# EAGLE schematic arduino_fio (EAGLE 5.00)
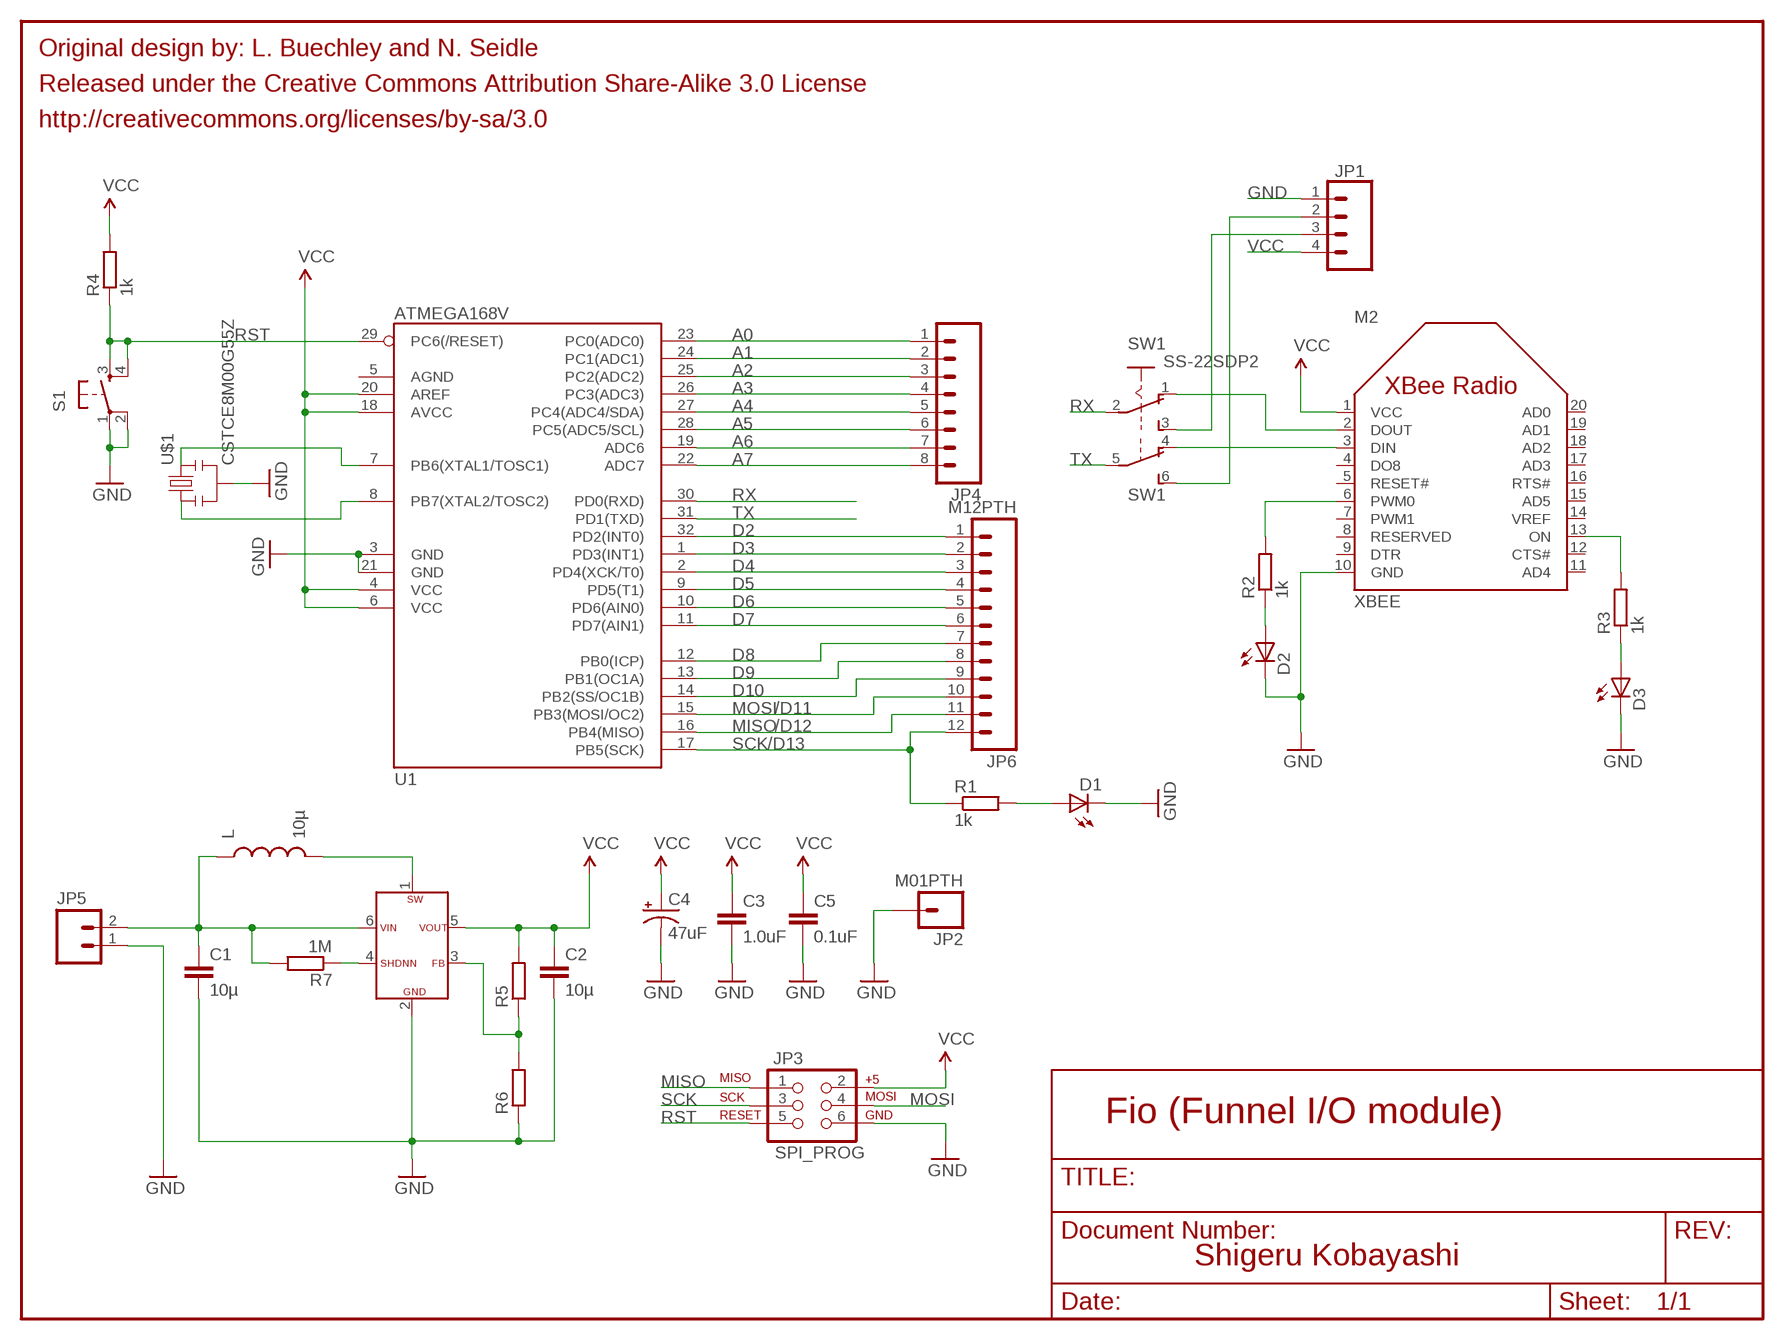
[diagram p0: schematic, sheet 1]

## Parts
C1  10µ  C-EUC0805K  [C0805K]
C2  10µ  C-EUC0805K  [C0805K]
C3  1.0uF  CAP0603  [0603]
C4  47uF  CAP_POL3528  [EIA3528]
C5  0.1uF  CAP0603  [0603]
D1  LEDCHIPLED_0805  [CHIPLED_0805]
D2  LEDCHIPLED_0805  [CHIPLED_0805]
D3  LEDCHIPLED_0805  [CHIPLED_0805]
IC1  AS1322  [SOT23-6]
JP1  Serial  M04PTH  [1X04]
JP2  M01PTH  [1X01]
JP3  SPI_PROG  AVR_SPI_PRG_6NS  [2X3-NS]
JP4  M08  [1X08]
JP5  M02-JST-2MM-SMT  [S2B-PH]
JP6  M12PTH  [1X12]
L  10µ  A921CY  [D63LCB]
M2  XBEE  [XBEE]
R1  1k  R-EU_R0603  [R0603]
R2  1k  R-EU_R0603  [R0603]
R3  1k  R-EU_R0603  [R0603]
R4  1k  R-EU_R0603  [R0603]
R5  R-EU_R0603  [R0603]
R6  R-EU_R0603  [R0603]
R7  1M  R-EU_R0603  [R0603]
S1  TAC_SWITCHSND  [TACTILE_SWITCH_SMD]
SW1  SS-22SDP2  [SS-22SDP2]
U1  ATMEGA168V  ATMEGA168  [TQFP32-08]
U$1  CSTCE8M00G55Z  RESONATORSMD  [RESONATOR-SMD]

## Nets
A0: JP4.1 U1.23(PC0(ADC0))
A1: JP4.2 U1.24(PC1(ADC1))
A2: JP4.3 U1.25(PC2(ADC2))
A3: JP4.4 U1.26(PC3(ADC3))
A4: JP4.5 U1.27(PC4(ADC4/SDA))
A5: JP4.6 U1.28(PC5(ADC5/SCL))
A6: JP4.7 U1.19(ADC6)
A7: JP4.8 U1.22(ADC7)
D2: JP6.1 U1.32(PD2(INT0))
D3: JP6.2 U1.1(PD3(INT1))
D4: JP6.3 U1.2(PD4(XCK/T0))
D5: JP6.4 U1.9(PD5(T1))
D6: JP6.5 U1.10(PD6(AIN0))
D7: JP6.6 U1.11(PD7(AIN1))
D8: JP6.7 U1.12(PB0(ICP))
D9: JP6.8 U1.13(PB1(OC1A))
D10: JP6.9 U1.14(PB2(SS/OC1B))
GND [VCC]: C1.2 C2.2 C3.2 C4.C(-) C5.2 D1.C D2.C D3.C IC1.2(GND) JP1.1 JP2.1 JP3.6 JP5.1 M2.10(GND) R6.1 S1.1 S1.2 U1.3(GND) U1.21(GND) U$1.2
MISO: JP3.1 JP6.11 U1.16(PB4(MISO))
MOSI: JP3.4 JP6.10 U1.15(PB3(MOSI/OC2))
N$1: M2.13(ON) R3.2
N$2: D1.A R1.2
N$3: D2.A R2.1
N$4: M2.6(PWM0) R2.2
N$5: M2.2(DOUT) SW1.1(O)
N$6: D3.A R3.1
N$7: M2.3(DIN) SW1.4(O)
N$8: JP1.2 SW1.6(S)
N$9: JP1.3 SW1.3(S)
N$10: U1.7(PB6(XTAL1/TOSC1)) U$1.3
N$11: IC1.3(FB) R5.1 R6.2
N$12: U1.8(PB7(XTAL2/TOSC2)) U$1.1
N$13: C1.1 IC1.6(VIN) JP5.2 L.P$1 R7.2
N$14: IC1.1(SW) L.P$2
N$15: IC1.4(SHDNN) R7.1
RST: JP3.5 R4.1 S1.3 S1.4 U1.29(PC6(/RESET))
RX: SW1.2(P) U1.30(PD0(RXD))
SCK: JP3.3 JP6.12 R1.1 U1.17(PB5(SCK))
TX: SW1.5(P) U1.31(PD1(TXD))
VCC [VCC]: C2.1 C3.1 C4.A(+) C5.1 IC1.5(VOUT) JP1.4 JP3.2 M2.1(VCC) R4.2 R5.2 U1.4(VCC) U1.6(VCC) U1.18(AVCC) U1.20(AREF)
Unconnected: M2.4(DO8) M2.5(RESET#) M2.7(PWM1) M2.8(RESERVED) M2.9(DTR) M2.11(AD4) M2.12(CTS#) M2.14(VREF) M2.15(AD5) M2.16(RTS#) M2.17(AD3) M2.18(AD2) M2.19(AD1) M2.20(AD0) U1.5(AGND)

## Notes on the sheet
- Original design by: L. Buechley and N. Seidle
- Released under the Creative Commons Attribution Share-Alike 3.0 License
- http://creativecommons.org/licenses/by-sa/3.0
- /D11
- /D12
- /D13
- Fio (Funnel I/O module)
- Shigeru Kobayashi

## Library data of the parts
C1 C2 = rcl:C-EU: CAPACITOR, European symbol
C3 C5 = SparkFun:CAP: Capacitor Standard 0603 ceramic capacitor, and 0.1" leaded capacitor.
C4 = SparkFun:CAP_POL: Capacitor Polarized These are standard SMD and PTH capacitors. Normally 10uF, 47uF, and 100uF in electrolytic and tantalum varieties. Always verify the external diameter of the through hole cap, it varies with capacity, voltage, and manufacturer. The EIA devices should be standard.
D1-D3 = led:LED: LED OSRAM: - CHIPLED LG R971, LG N971, LY N971, LG Q971, LY Q971, LO R971, LY R971 LH N974, LH R974 LS Q976, LO Q976, LY Q976 LO Q996 - Hyper CHIPLED LW Q18S LB Q993, LB Q99A, LB R99A - SideLED LS A670, LO A670, LY A670, LG A670, LP A670 LB A673, LV A673, LT A673, LW A673 LH A674 LY A675 LS A676, LA A676, LO A676, LY A676, LW A676 LS A679, LY A679, LG A679 - Hyper Micro SIDELED® LS Y876, LA Y876, LO Y876, LY Y876 LT Y87S - SmartLED LW L88C, LW L88S LB L89C, LB L89S, LG L890 LS L89K, LO L89K, LY L89K LS L896, LA L896, LO L896, LY L896 - TOPLED LS T670, LO T670, LY T670, LG T670, LP T670 LSG T670, LSP T670, LSY T670, LOP T670, LYG T670 LG T671, LOG T671, LSG T671 LB T673, LV T673, LT T673, LW T673 LH T674 LS T676, LA T676, LO T676, LY T676, LB T676, LH T676, LSB T676, LW T676 LB T67C, LV T67C, LT T67C, LS T67K, LO T67K, LY T67K, LW E67C LS E67B, LA E67B, LO E67B, LY E67B, LB E67C, LV E67C, LT E67C LW T67C LS T679, LY T679, LG T679 LS T770, LO T770, LY T770, LG T770, LP T770 LB T773, LV T773, LT T773, LW T773 LH T774 LS E675, LA E675, LY E675, LS T675 LS T776, LA T776, LO T776, LY T776, LB T776 LHGB T686 LT T68C, LB T68C - Hyper Mini TOPLED® LB M676 - Mini TOPLED Santana® LG M470 LS M47K, LO M47K, LY M47K Source: http://www.osram.convergy.de - LUMILED® LXK2-PW12-R00, LXK2-PW12-S00, LXK2-PW14-U00, LXK2-PW14-V00 LXK2-PM12-R00, LXK2-PM12-S00, LXK2-PM14-U00 LXK2-PE12-Q00, LXK2-PE12-R00, LXK2-PE12-S00, LXK2-PE14-T00, LXK2-PE14-U00 LXK2-PB12-K00, LXK2-PB12-L00, LXK2-PB12-M00, LXK2-PB14-N00, LXK2-PB14-P00, LXK2-PB14-Q00 LXK2-PR12-L00, LXK2-PR12-M00, LXK2-PR14-Q00, LXK2-PR14-R00 LXK2-PD12-Q00, LXK2-PD12-R00, LXK2-PD12-S00 LXK2-PH12-R00, LXK2-PH12-S00 LXK2-PL12-P00, LXK2-PL12-Q00, LXK2-PL12-R00 Source: www.luxeon.com
IC1 = austriamicrosystems_as1322:AS1322
JP1 = SparkFun:M04: Header 4 Standard 4-pin 0.1" header. Use with straight break away headers (SKU : PRT-00116), right angle break away headers (PRT-00553), swiss pins (PRT-00743), machine pins (PRT-00117), and female headers (PRT-00115). Molex polarized connector foot print use with SKU : PRT-08231 with associated crimp pins and housings.
JP2 = SparkFun:M01: Header 1 Standard 1-pin 0.1" header. Use with straight break away headers (SKU : PRT-00116), right angle break away headers (PRT-00553), swiss pins (PRT-00743), machine pins (PRT-00117), and female headers (PRT-00115).
JP3 = SparkFun:AVR_SPI_PRG_6
JP4 = SparkFun:M08: Header 8 Standard 8-pin 0.1" header. Use with straight break away headers (SKU : PRT-00116), right angle break away headers (PRT-00553), swiss pins (PRT-00743), machine pins (PRT-00117), and female headers (PRT-00115).
JP5 = SparkFun:M02: Header 2 Standard 2-pin 0.1" header. Use with straight break away headers (SKU : PRT-00116), right angle break away headers (PRT-00553), swiss pins (PRT-00743), machine pins (PRT-00117), and female headers (PRT-00115). Molex polarized connector foot print use with SKU : PRT-08233 with associated crimp pins and housings.
JP6 = SparkFun:M12: Header 12 Standard 12-pin 0.1" header. Use with straight break away headers (SKU : PRT-00116), right angle break away headers (PRT-00553), swiss pins (PRT-00743), machine pins (PRT-00117), and female headers (PRT-00115).
L = inductor_toko:A921CY
M2 = digi_xbee:XBEE
R1-R7 = rcl:R-EU_: RESISTOR, European symbol
S1 = SparkFun:TAC_SWITCH: Momentary Switch Button commonly used for reset or general input. Spark Fun Electronics SKU : COM-00097
SW1 = nikkai_ss:SS-22S
U1 = SparkFun:ATMEGA168
U$1 = SparkFun:RESONATOR: Resonator Small SMD resonator. This is the itty bitty 10/20MHz resonators with built in caps. CSTCE10M0G55 and CSTCE20M0V53. Footprint has been reviewed closely but hasn't been tested yet.

## Net classes
0 Default: width 0.203 mm
1 VCC: width 0.381 mm
2 LEDPower: width 0.203 mm
3 ButtonSignal: width 0.203 mm